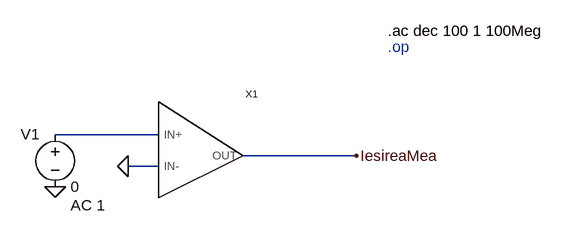
[diagram p0: schematic Draft2.asc]
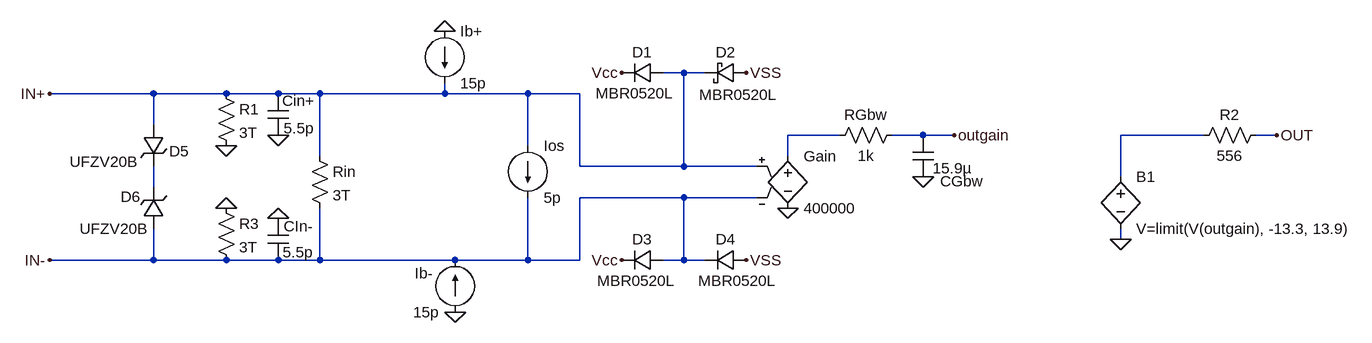
[diagram p1: sub-circuit amplificatoroperational.asc]
Draft2.asc, the LTspice schematic file:
Version 4.1
SHEET 1 880 680
WIRE 96 320 -64 320
WIRE 400 352 224 352
WIRE 96 368 48 368
FLAG 400 352 IesireaMea
FLAG -64 400 0
FLAG 48 368 0
SYMBOL AmplificatorOperational 112 352 R0
SYMATTR InstName X1
SYMBOL voltage -64 304 R0
WINDOW 0 -53 15 Left 2
WINDOW 123 24 124 Left 2
WINDOW 39 0 0 Left 0
SYMATTR InstName V1
SYMATTR Value 0
SYMATTR Value2 AC 1
TEXT 448 160 Left 2 !.ac dec 100 1 100Meg
TEXT 448 184 Left 2 ;.op

amplificatoroperational.asc, the sub-circuit schematic file:
Version 4.1
SHEET 1 1092 680
WIRE 16 -16 -16 -16
WIRE 48 -16 16 -16
WIRE -800 16 -960 16
WIRE -688 16 -800 16
WIRE -608 16 -688 16
WIRE -544 16 -608 16
WIRE -352 16 -352 0
WIRE -352 16 -544 16
WIRE -224 16 -352 16
WIRE -144 16 -224 16
WIRE -800 64 -800 16
WIRE 256 80 176 80
WIRE 384 80 336 80
WIRE 432 80 384 80
WIRE 816 80 688 80
WIRE 928 80 896 80
WIRE -224 96 -224 16
WIRE -544 112 -544 16
WIRE 176 112 176 80
WIRE -144 128 -144 16
WIRE 16 128 16 -16
WIRE 16 128 -144 128
WIRE 128 128 16 128
WIRE 688 144 688 80
WIRE -800 160 -800 128
WIRE 16 176 -144 176
WIRE 128 176 16 176
WIRE 688 240 688 224
WIRE -800 272 -800 224
WIRE -800 272 -960 272
WIRE -688 272 -800 272
WIRE -608 272 -688 272
WIRE -544 272 -544 192
WIRE -544 272 -608 272
WIRE -336 272 -544 272
WIRE -224 272 -224 176
WIRE -224 272 -336 272
WIRE -144 272 -144 176
WIRE -144 272 -224 272
WIRE 16 272 16 176
WIRE 16 272 -16 272
WIRE 48 272 16 272
FLAG -960 16 IN+
FLAG -960 272 IN-
FLAG 176 192 0
FLAG -336 352 0
FLAG -352 -80 0
FLAG 384 144 0
FLAG 432 80 outgain
FLAG 928 80 OUT
FLAG 688 240 0
FLAG -608 208 0
FLAG -608 80 0
FLAG -80 272 Vcc
FLAG -80 -16 Vcc
FLAG 112 -16 VSS
FLAG 112 272 VSS
FLAG -688 192 0
FLAG -688 96 0
SYMBOL e 176 96 R0
SYMATTR InstName Gain
SYMATTR Value 400000
SYMBOL current -352 -80 R0
SYMATTR InstName Ib+
SYMATTR Value 15p
SYMBOL current -336 352 R180
WINDOW 0 34 60 Left 2
WINDOW 3 24 0 Left 2
SYMATTR InstName Ib-
SYMATTR Value 15p
SYMBOL res 352 64 R90
WINDOW 0 0 56 VBottom 2
WINDOW 3 32 56 VTop 2
SYMATTR InstName RGbw
SYMATTR Value 1k
SYMBOL cap 368 80 R0
WINDOW 0 42 71 Left 2
WINDOW 3 31 51 Left 2
SYMATTR InstName CGbw
SYMATTR Value 15.9µ
SYMBOL current -224 96 R0
SYMATTR InstName Ios
SYMATTR Value 5p
SYMBOL bv 688 128 R0
SYMATTR InstName B1
SYMATTR Value V=limit(V(outgain), -13.3, 13.9)
SYMBOL res 912 64 R90
WINDOW 0 0 56 VBottom 2
WINDOW 3 32 56 VTop 2
SYMATTR InstName R2
SYMATTR Value 556
SYMBOL res -560 96 R0
SYMATTR InstName Rin
SYMATTR Value 3T
SYMBOL cap -624 16 R0
WINDOW 0 22 11 Left 2
WINDOW 3 24 53 Left 2
SYMATTR InstName Cin+
SYMATTR Value 5.5p
SYMBOL cap -624 208 R0
WINDOW 0 24 12 Left 2
WINDOW 3 23 52 Left 2
SYMATTR InstName CIn-
SYMATTR Value 5.5p
SYMBOL diode -16 -32 R90
WINDOW 0 0 32 VBottom 2
WINDOW 3 32 43 VTop 2
SYMATTR InstName D1
SYMATTR Value MBR0520L
SYMBOL schottky 112 -32 R90
WINDOW 0 0 32 VBottom 2
WINDOW 3 34 12 VTop 2
SYMATTR InstName D2
SYMATTR Value MBR0520L
SYMATTR Description Diode
SYMATTR Type diode
SYMBOL diode -16 256 R90
WINDOW 0 0 32 VBottom 2
WINDOW 3 32 41 VTop 2
SYMATTR InstName D3
SYMATTR Value MBR0520L
SYMBOL diode 112 256 R90
WINDOW 0 0 32 VBottom 2
WINDOW 3 32 14 VTop 2
SYMATTR InstName D4
SYMATTR Value MBR0520L
SYMBOL zener -816 64 R0
WINDOW 0 40 41 Left 2
WINDOW 3 -113 57 Left 2
SYMATTR InstName D5
SYMATTR Value UFZV20B
SYMBOL zener -784 224 R180
WINDOW 0 36 49 Left 2
WINDOW 3 24 0 Left 2
SYMATTR InstName D6
SYMATTR Value UFZV20B
SYMBOL res -704 0 R0
SYMATTR InstName R1
SYMATTR Value 3T
SYMBOL res -704 176 R0
SYMATTR InstName R3
SYMATTR Value 3T

The netlist it stands for:
* Draft2.asc
X§X1 N001 0 IesireaMea amplificatoroperational
V1 N001 0 0 AC 1

* block symbol definitions
.subckt amplificatoroperational IN+ IN- OUT
E§Gain N001 0 IN+ IN- 400000
Ib+ 0 IN+ 15p
Ib- 0 IN- 15p
RGbw outgain N001 1k
CGbw outgain 0 15.9µ
Ios IN+ IN- 5p
B1 N002 0 V=limit(V(outgain), -13.3, 13.9)
R2 OUT N002 556
Rin IN+ IN- 3T
Cin+ IN+ 0 5.5p
CIn- 0 IN- 5.5p
D1 IN+ Vcc MBR0520L
D2 VSS IN+ MBR0520L
D3 IN- Vcc MBR0520L
D4 VSS IN- MBR0520L
D5 IN+ N003 UFZV20B
D6 IN- N003 UFZV20B
R1 IN+ 0 3T
R3 0 IN- 3T
.ends amplificatoroperational

.model D D
.lib standard.dio
.ac dec 100 1 100Meg
* .op
.backanno
.end

* Results of the author's LTspice run, read from the files saved beside the schematic
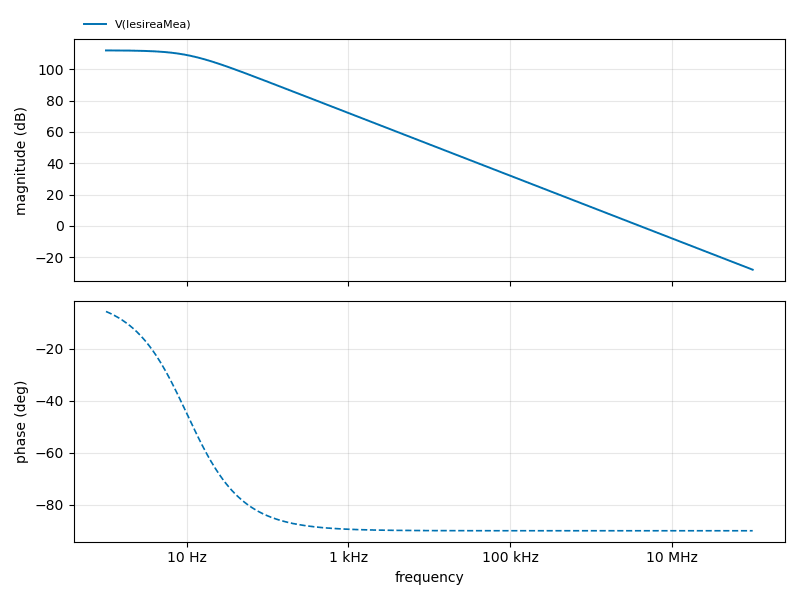
[diagram p2: AC Analysis of Draft2.asc, plotted from the saved traces]
* AC Analysis, 1 run:
*   V(IesireaMea): 112.00 dB at 1 Hz, -27.95 dB at 100 MHz, peak 112.00 dB at 1 Hz, 3 dB below the peak at 10.11 Hz